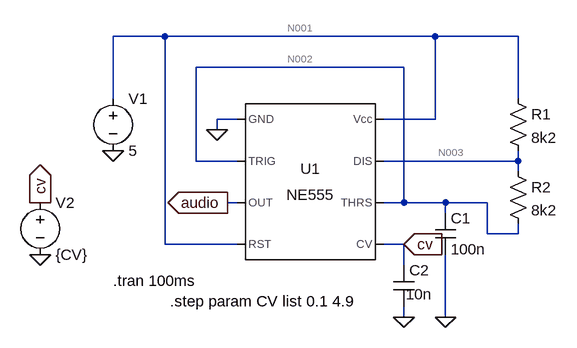
[diagram p0: schematic osc555cv.asc]
osc555cv.asc, the LTspice schematic file:
Version 4
SHEET 1 1012 680
WIRE 192 112 112 112
WIRE 608 112 192 112
WIRE 736 112 608 112
WIRE 560 160 240 160
WIRE 112 208 112 112
WIRE 736 208 736 112
WIRE 304 240 272 240
WIRE 608 240 608 112
WIRE 608 240 528 240
WIRE 272 256 272 240
WIRE 240 304 240 160
WIRE 304 304 240 304
WIRE 736 304 736 288
WIRE 736 304 528 304
WIRE 736 320 736 304
WIRE 304 368 288 368
WIRE 560 368 560 160
WIRE 560 368 528 368
WIRE 624 368 560 368
WIRE 688 368 624 368
WIRE 624 384 624 368
WIRE 688 416 688 368
WIRE 736 416 736 400
WIRE 736 416 688 416
WIRE 192 432 192 112
WIRE 304 432 192 432
WIRE 560 432 528 432
WIRE 560 464 560 432
WIRE 560 544 560 528
WIRE 624 544 624 448
FLAG 112 288 0
FLAG 560 544 0
FLAG 624 544 0
FLAG 288 368 audio
IOPIN 288 368 Out
FLAG 272 256 0
FLAG 0 448 0
FLAG 0 368 cv
IOPIN 0 368 Out
FLAG 560 432 cv
IOPIN 560 432 In
SYMBOL NE555 416 336 R0
SYMATTR InstName U1
SYMBOL Res 720 192 R0
SYMATTR InstName R1
SYMATTR Value 8k2
SYMBOL Res 720 304 R0
SYMATTR InstName R2
SYMATTR Value 8k2
SYMBOL Cap 608 384 R0
SYMATTR InstName C1
SYMATTR Value 100n
SYMBOL Voltage 112 192 R0
SYMATTR InstName V1
SYMATTR Value 5
SYMBOL Cap 544 464 R0
WINDOW 3 19 45 Left 2
SYMATTR InstName C2
SYMATTR Value 10n
SYMBOL Voltage 0 352 R0
SYMATTR InstName V2
SYMATTR Value {CV}
TEXT 112 488 Left 2 !.tran 100ms
TEXT 200 520 Left 2 !.step param CV list 0.1 4.9

The netlist it stands for:
* osc555cv.asc
XU1 0 N002 audio N001 cv N002 N003 N001 NE555  ; pins GND TRIG OUT RST CV THRS DIS Vcc
R1 N001 N003 8k2
R2 N003 N002 8k2
C1 N002 0 100n
V1 N001 0 5
C2 cv 0 10n
V2 cv 0 {CV}
.tran 100ms
.step param CV list 0.1 4.9
.lib NE555.sub
.backanno
.end

* Results of the author's LTspice run, read from the files saved beside the schematic
* Operating Point (first step), zero values left out:
*   cv = 100 m
*   V(n002) = 5 V
*   V(cv) = 100 mV
*   V(n001) = 5 V
*   V(n003) = 5 V
*   V(audio) = 5 V
*   I(R2) = 10 nA
*   I(R1) = 16.67 nA
*   I(V2) = 970 µA
*   I(V1) = -2.258 mA
*   Ix(u1:1) = -1.288 mA
*   Ix(u1:2) = 5 nA
*   Ix(u1:4) = 22.67 µA
*   Ix(u1:5) = -970 µA
*   Ix(u1:6) = 5 nA
*   Ix(u1:7) = 6.671 nA
*   Ix(u1:8) = 2.235 mA
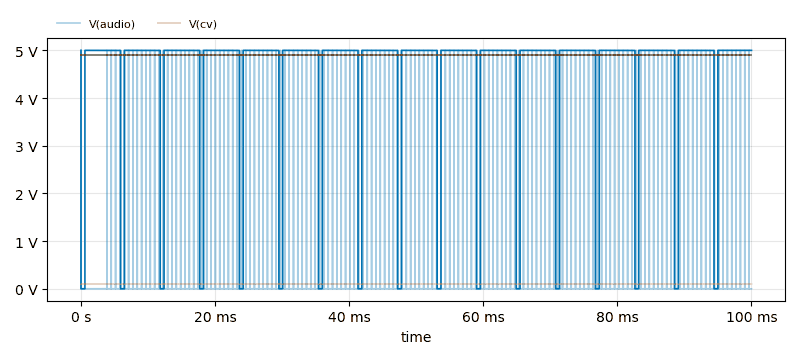
[diagram p1: Transient Analysis of osc555cv.asc, plotted from the saved traces]
* Transient Analysis, 2 runs:
*   V(audio) [cv=0.1]: min 30 µV, max 5 V, average 129.5 mV, rms 804.3 mV, last 30 µV
*   V(audio) [cv=4.9]: min 30 µV, max 5 V, average 4.515 V, rms 4.751 V, last 5 V
*   V(cv) [cv=0.1]: min 100 mV, max 100 mV, average 100 mV, rms 100 mV, last 100 mV
*   V(cv) [cv=4.9]: min 4.9 V, max 4.9 V, average 4.9 V, rms 4.9 V, last 4.9 V